# Altium project Guppy Buddy Rev A.PrjPCB (part 3 of 7)

## Sheet SOM Power.SchDoc: SOM Power
size Tabloid; ApprovedBy: NA; CompanyName: Cospan Design LLC; DrawnBy: David McCoy; Engineer: David McCoy; DocumentNumber: 3; Revision: A; SheetNumber: 3; SheetTotal: 18; Client: OSH; Project: Guppy Buddy; ProjectPrettyName: Guppy Buddy
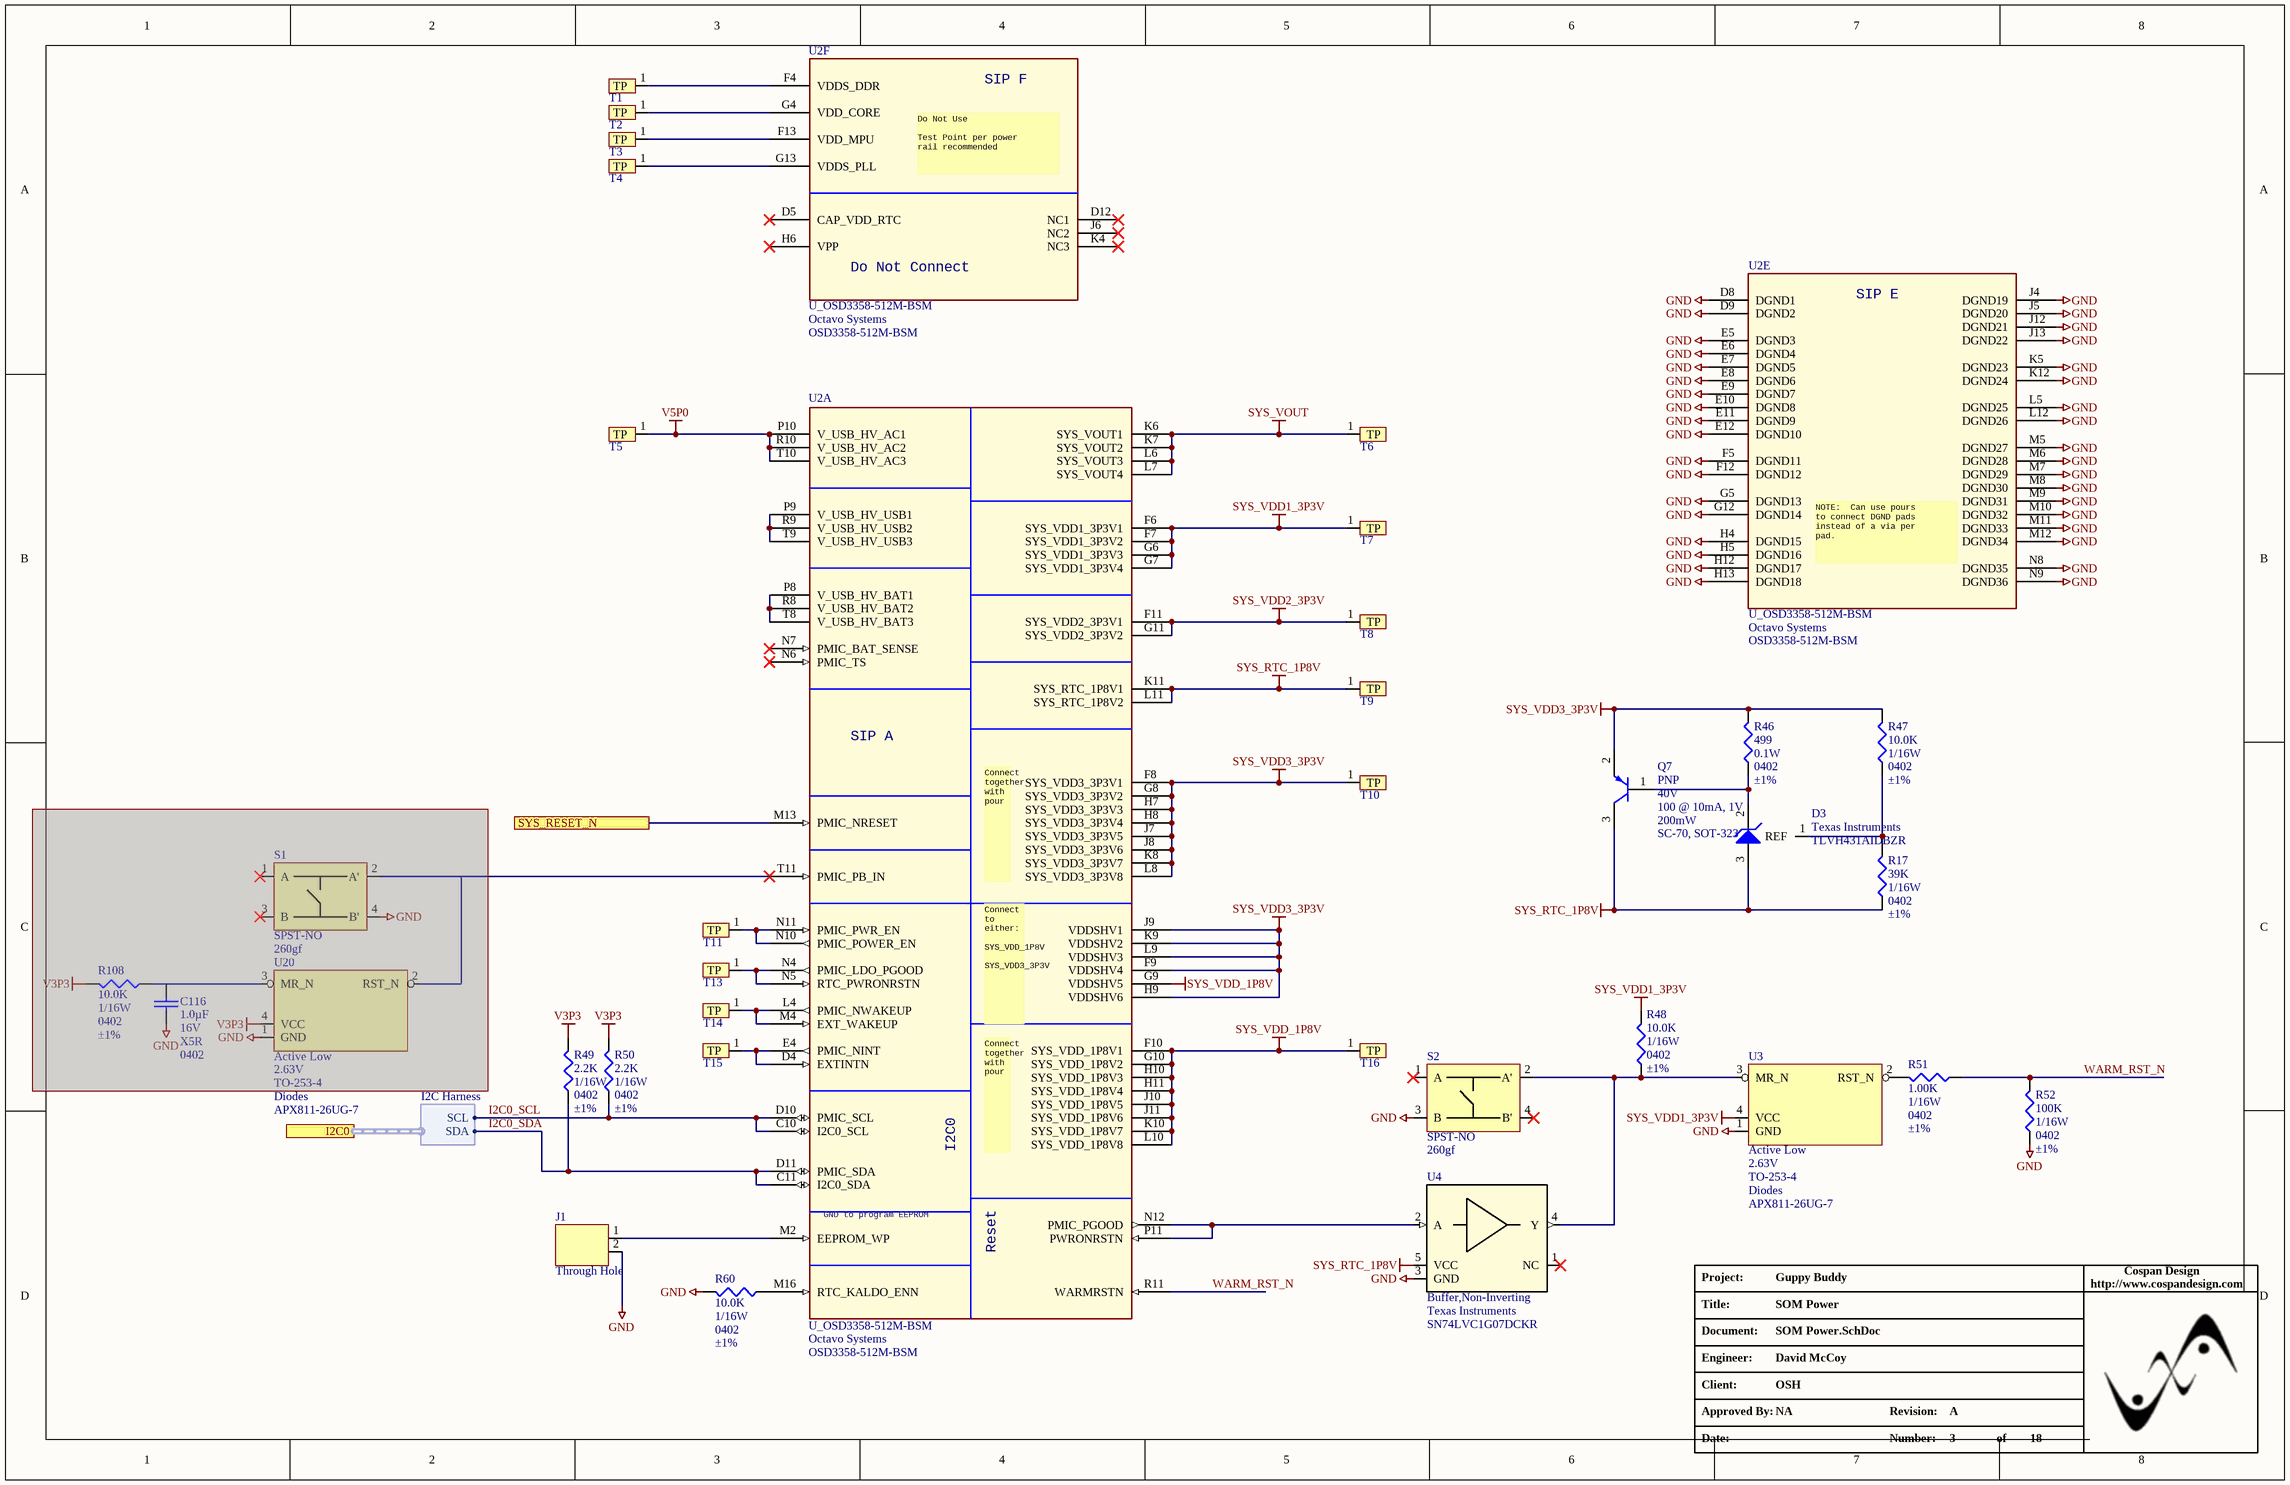
[diagram p3: SOM Power.SchDoc]

### Parts
(Parts that share a designator on the sheet are numbered #1, #2 ... from top to bottom, then left to right.)
C116  Capacitance: 1.0µF  Voltage - Rated: 16V  Temperature Coefficient: X5R  Package / Case: 0402  [C_0402]  (hidden comment: 1.0uF)  (masked out: inside a compile mask, not in the netlist)
D3  Manufacturer 1: Texas Instruments  Manufacturer Part Number 1: TLVH431AIDBZR  [SOT23]  (hidden comment: D_TLVH431AIDBZR)
J1  Mounting Type: Through Hole  [HDR_1X2]  (hidden comment: J_HDR1X2_JUMPER)
Q7  Voltage - Collector Emitter Breakdown (Max): 40V  DC Current Gain (hFE) (Min) @ Ic, Vce: 100 @ 10mA, 1V  Power - Max: 200mW  Package / Case: SC-70, SOT-323  [SOT-23A]  (hidden comment: PNP)
R17  Resistance In Ohms: 39K  Power (Watts): 1/16W  Case: 0402  Tolerance: ±1%  [R_0402]  (hidden comment: R_0402_39K)
R46  Resistance In Ohms: 499  Power (Watts): 0.1W  Case: 0402  Tolerance: ±1%  [R_0402]  (hidden comment: R_0402_499.0)
R47  Resistance In Ohms: 10.0K  Power (Watts): 1/16W  Case: 0402  Tolerance: ±1%  [R_0402]  (hidden comment: R_0402_10.0K)
R48  Resistance In Ohms: 10.0K  Power (Watts): 1/16W  Case: 0402  Tolerance: ±1%  [R_0402]  (hidden comment: R_0402_10.0K)
R49  Resistance In Ohms: 2.2K  Power (Watts): 1/16W  Case: 0402  Tolerance: ±1%  [R_0402]  (hidden comment: R_0402_2.2K)
R50  Resistance In Ohms: 2.2K  Power (Watts): 1/16W  Case: 0402  Tolerance: ±1%  [R_0402]  (hidden comment: R_0402_2.2K)
R51  Resistance In Ohms: 1.00K  Power (Watts): 1/16W  Case: 0402  Tolerance: ±1%  [R_0402]  (hidden comment: 1.0k Ohms)
R52  Resistance In Ohms: 100K  Power (Watts): 1/16W  Case: 0402  Tolerance: ±1%  [R_0402]  (hidden comment: R_0402_100K)
R60  Resistance In Ohms: 10.0K  Power (Watts): 1/16W  Case: 0402  Tolerance: ±1%  [R_0402]  (hidden comment: R_0402_10.0K)
R108#1  Resistance In Ohms: 10.0K  Power (Watts): 1/16W  Case: 0402  Tolerance: ±1%  [R_0402]  (hidden comment: R_0402_10.0K)  (masked out: inside a compile mask, not in the netlist)
S1#1  Circuit: SPST-NO  Operating Force: 260gf  [Tact Switch]  (hidden comment: S_TACTILE_BUTTON)  (masked out: inside a compile mask, not in the netlist)
S2  Circuit: SPST-NO  Operating Force: 260gf  [Tact Switch]  (hidden comment: S_TACTILE_BUTTON)
T1  TEST_POINT_SMALL  [TestPointSmall]  (value not drawn)  (no BOM)
T2  TEST_POINT_SMALL  [TestPointSmall]  (value not drawn)  (no BOM)
T3  TEST_POINT_SMALL  [TestPointSmall]  (value not drawn)  (no BOM)
T4  TEST_POINT_SMALL  [TestPointSmall]  (value not drawn)  (no BOM)
T5  TEST_POINT_SMALL  [TestPointSmall]  (value not drawn)  (no BOM)
T6  TEST_POINT_SMALL  [TestPointSmall]  (value not drawn)  (no BOM)
T7  TEST_POINT_SMALL  [TestPointSmall]  (value not drawn)  (no BOM)
T8  TEST_POINT_SMALL  [TestPointSmall]  (value not drawn)  (no BOM)
T9  TEST_POINT_SMALL  [TestPointSmall]  (value not drawn)  (no BOM)
T10  TEST_POINT_SMALL  [TestPointSmall]  (value not drawn)  (no BOM)
T11  TEST_POINT_SMALL  [TestPointSmall]  (value not drawn)  (no BOM)
T13  TEST_POINT_SMALL  [TestPointSmall]  (value not drawn)  (no BOM)
T14  TEST_POINT_SMALL  [TestPointSmall]  (value not drawn)  (no BOM)
T15  TEST_POINT_SMALL  [TestPointSmall]  (value not drawn)  (no BOM)
T16  TEST_POINT_SMALL  [TestPointSmall]  (value not drawn)  (no BOM)
U2  U_OSD3358-512M-BSM  Manufacturer 1: Octavo Systems  Manufacturer Part Number 1: OSD3358-512M-BSM  [OSD335X-BGA-256]  (parts A,E,F of 6)
U3  Reset: Active Low  Threshold Voltage: 2.63V  Case/Package: TO-253-4  Manufacturer 1: Diodes  Manufacturer Part Number 1: APX811-26UG-7  [SOT190P237X120-4N]  (hidden comment: U_APX811-26UG-7)
U4  Logic Function: Buffer,Non-Inverting  Manufacturer 1: Texas Instruments  Manufacturer Part Number 1: SN74LVC1G07DCKR  [DCK5]  (hidden comment: U_SN74LVC1G07DCKR)
U20  Reset: Active Low  Threshold Voltage: 2.63V  Case/Package: TO-253-4  Manufacturer 1: Diodes  Manufacturer Part Number 1: APX811-26UG-7  [SOT190P237X120-4N]  (hidden comment: U_APX811-26UG-7)  (masked out: inside a compile mask, not in the netlist)

### Ports
I2C0 (harness I2C Harness), SYS_RESET_N

### Harnesses
I2C Harness: SCL, SDA

### Nets
GND: J1.2 R52.2 R60.1 S2.3(B) U2.D8(DGND1) U2.D9(DGND2) U2.E5(DGND3) U2.E6(DGND4) U2.E7(DGND5) U2.E8(DGND6) U2.E9(DGND7) U2.E10(DGND8) U2.E11(DGND9) U2.E12(DGND10) U2.F5(DGND11) U2.F12(DGND12) U2.G5(DGND13) U2.G12(DGND14) U2.H4(DGND15) U2.H5(DGND16) U2.H12(DGND17) U2.H13(DGND18) U2.J4(DGND19) U2.J5(DGND20) U2.J12(DGND21) U2.J13(DGND22) U2.K5(DGND23) U2.K12(DGND24) U2.L5(DGND25) U2.L12(DGND26) U2.M5(DGND27) U2.M6(DGND28) U2.M7(DGND29) U2.M8(DGND30) U2.M9(DGND31) U2.M10(DGND32) U2.M11(DGND33) U2.M12(DGND34) U2.N8(DGND35) U2.N9(DGND36) U3.1(GND) U4.3(GND)
SYS_RTC_1P8V: D3.3(A) Q7.3(C) R17.1 T9.1(TP) U2.K11(SYS_RTC_1P8V1) U2.L11(SYS_RTC_1P8V2) U4.5(VCC)
SYS_VDD1_3P3V: R48.1 T7.1(TP) U2.F6(SYS_VDD1_3P3V1) U2.F7(SYS_VDD1_3P3V2) U2.G6(SYS_VDD1_3P3V3) U2.G7(SYS_VDD1_3P3V4) U3.4(VCC)
SYS_VDD2_3P3V: T8.1(TP) U2.F11(SYS_VDD2_3P3V1) U2.G11(SYS_VDD2_3P3V2)
SYS_VDD3_3P3V: Q7.2(E) R46.2 R47.2 T10.1(TP) U2.F8(SYS_VDD3_3P3V1) U2.F9(VDDSHV4) U2.G8(SYS_VDD3_3P3V2) U2.H7(SYS_VDD3_3P3V3) U2.H8(SYS_VDD3_3P3V4) U2.H9(VDDSHV6) U2.J7(SYS_VDD3_3P3V5) U2.J8(SYS_VDD3_3P3V6) U2.J9(VDDSHV1) U2.K8(SYS_VDD3_3P3V7) U2.K9(VDDSHV2) U2.L8(SYS_VDD3_3P3V8) U2.L9(VDDSHV3)
SYS_VDD_1P8V: T16.1(TP) U2.F10(SYS_VDD_1P8V1) U2.G9(VDDSHV5) U2.G10(SYS_VDD_1P8V2) U2.H10(SYS_VDD_1P8V3) U2.H11(SYS_VDD_1P8V4) U2.J10(SYS_VDD_1P8V5) U2.J11(SYS_VDD_1P8V6) U2.K10(SYS_VDD_1P8V7) U2.L10(SYS_VDD_1P8V8)
SYS_VOUT: T6.1(TP) U2.K6(SYS_VOUT1) U2.K7(SYS_VOUT2) U2.L6(SYS_VOUT3) U2.L7(SYS_VOUT4)
V3P3: R49.1 R50.1
V5P0: T5.1(TP) U2.P10(V_USB_HV_AC1) U2.R10(V_USB_HV_AC2) U2.T10(V_USB_HV_AC3)
I2C0_SCL: R50.2 U2.C10(I2C0_SCL) U2.D10(PMIC_SCL) ; port I2C0.SCL
I2C0_SDA: R49.2 U2.C11(I2C0_SDA) U2.D11(PMIC_SDA) ; port I2C0.SDA
WARM_RST_N: R51.2 R52.1 U2.R11(WARMRSTN)
NetD3_1: D3.1(REF) R17.2 R47.1
NetD3_2: D3.2(K) Q7.1(B) R46.1
NetJ1_1: J1.1 U2.M2(EEPROM_WP)
NetR48_2: R48.2 S2.2(A') U3.3(MR_N) U4.4(Y)
NetR51_1: R51.1 U3.2(RST_N)
NetR60_2: R60.2 U2.M16(RTC_KALDO_ENN)
NetT1_1: T1.1(TP) U2.F4(VDDS_DDR)
NetT2_1: T2.1(TP) U2.G4(VDD_CORE)
NetT3_1: T3.1(TP) U2.F13(VDD_MPU)
NetT4_1: T4.1(TP) U2.G13(VDDS_PLL)
NetT11_1: T11.1(TP) U2.N10(PMIC_POWER_EN) U2.N11(PMIC_PWR_EN)
NetT13_1: T13.1(TP) U2.N4(PMIC_LDO_PGOOD) U2.N5(RTC_PWRONRSTN)
NetT14_1: T14.1(TP) U2.L4(PMIC_NWAKEUP) U2.M4(EXT_WAKEUP)
NetT15_1: T15.1(TP) U2.D4(EXTINTN) U2.E4(PMIC_NINT)
NetU2_M13: U2.M13(PMIC_NRESET) ; port SYS_RESET_N
NetU2_N12: U2.N12(PMIC_PGOOD) U2.P11(PWRONRSTN) U4.2(A)
NetU2_P8: U2.P8(V_USB_HV_BAT1) U2.R8(V_USB_HV_BAT2) U2.T8(V_USB_HV_BAT3)
NetU2_P9: U2.P9(V_USB_HV_USB1) U2.R9(V_USB_HV_USB2) U2.T9(V_USB_HV_USB3)

Not connected (* = marked no-connect by the designer): S2 1(A)* 4(B')*; U2 D5(CAP_VDD_RTC)* D12(NC1)* H6(VPP)* J6(NC2)* K4(NC3)* N6(PMIC_TS)* N7(PMIC_BAT_SENSE)* T11(PMIC_PB_IN)*; U4 1(NC)*

### Notes on the sheet
- Project:
- http://www.cospandesign.com
- Cospan Design
- Document:
- Engineer:
- Title:
- Client:
- Approved By:
- Revision:
- Date:
- Number:
- of
- (in symbol U_OSD3358-512M-BSM, part A) SIP A; Connect together / with pour; Connect to either: / SYS_VDD_1P8V / SYS_VDD3_3P3V; I2C0; GND to program EEPROM; Reset
- (in symbol U_OSD3358-512M-BSM, part E) SIP E; NOTE:  Can use pours / to connect DGND pads / instead of a via per / pad.
- (in symbol U_OSD3358-512M-BSM, part F) SIP F; Do Not Use / Test Point per power / rail recommended; Do Not Connect

### Library data of the parts
C116 = C_0402_1.0UF_16V: CAP CER 1.0UF 16V X5R 0402; Manufacturer 1: Samsung; Manufacturer Part Number 1: CL05A105KO5NNNC; Tolerance: 10%; Description 1: Cap Ceramic 1uF 16V X5R 10% SMD 0402 85C Paper T/R; Supplier 1: Digi-Key; Stock 1: 26908; Pricing 1: 1=0.1, 10=0.062, 100=0.0276, 500=0.01968, 1000=0.01547, 2500=0.01406, 5000=0.01294 (USD); Packaging: Tape and Reel; ComponentLink1URL: http://ds.yuden.co.jp/TYCOMPAS/ut/detail.do?productNo=EMK105BJ105KV-F&fileName=EMK105BJ105KV-F_SS&mode=specSheetDownload; ComponentLink1Description: http://ds.yuden.co.jp/TYCOMPAS/ut/detail.do?productNo=EMK105BJ105KV-F&fileName=EMK105BJ105KV-F_SS&mode=specSheetDownload; Supplier Part Number 1: 1276-1067-6-ND; ComponentLink2URL: https://datasheet.ciiva.com/16207/cl05a105ko5nnnc-16207571.pdf; ComponentLink2Description: https://datasheet.ciiva.com/16207/cl05a105ko5nnnc-16207571.pdf; ComponentLink3URL: https://datasheet.ciiva.com/15195/getdatasheetpartid-355272-15195629.pdf; ComponentLink3Description: https://datasheet.ciiva.com/15195/getdatasheetpartid-355272-15195629.pdf; Mount: Surface Mount; Case/Package: 0402; Case Code (Metric): 1005; Case Code (Imperial): 0402; Contact Plating: Tin; Min Operating Temperature: -55°C; Max Operating Temperature: 85°C; Dielectric: X5R; Package Quantity: 1; Voltage Rating: 16V; Voltage: 16V; Length: 1mm; Height: 0.5mm; Width: 0.02inch; Thickness: 0.022inch; Depth: 0.5mm; Radiation Hardening: No
D3 = D_TLVH431AIDBZR: IC VREF SHUNT ADJ SOT23-3; Built_By: EMA_UL_Team; Type: DEV; C: Copyright (C) 2015 Accelerated Designs. All rights reserved; Output Voltage: 18V; Output Current: 70mA; Max Input Voltage: 20V; Number of Channels: 1; Tolerance: 1%; Max Output Current: 80mA; Temperature Coefficient: 129ppm/°C; Cathode Current: 100uA; Reference Type: Shunt,Adjustable; Vendor: Texas Instruments; Manufacturer_Part_Number: TLVH431AIDBZR; Manufacturer: Texas Instruments; RefDes: RefDes; Value: Value; Supplier 1: Digi-Key; Supplier Part Number 1: 296-17970-6-ND; Description 1: IC VREF SHUNT ADJ SOT23-3; Stock 1: 8302; Pricing 1: 1=0.75, 10=0.659, 100=0.5055, 500=0.39964, 1000=0.31971 (USD); Case/Package: SOT-23; Number of Pins: 3; Min Operating Temperature: -40°C; Max Operating Temperature: 125°C; Packaging: Tape and Reel; Package Quantity: 1; Max Output Voltage: 18V; Reference Voltage: 18V; Radiation Hardening: No; Lead Free: Lead Free; REACH SVHC: No SVHC; ComponentLink1URL: https://datasheet.ciiva.com/8055/1772203-8055424.pdf; ComponentLink1Description: https://datasheet.ciiva.com/8055/1772203-8055424.pdf; ComponentLink2URL: https://datasheet.ciiva.com/3236/tlvh432b-3236469.pdf; ComponentLink2Description: https://datasheet.ciiva.com/3236/tlvh432b-3236469.pdf; ComponentLink3URL: https://datasheet.ciiva.com/2006/tlvh431a-2006475.pdf; ComponentLink3Description: https://datasheet.ciiva.com/2006/tlvh431a-2006475.pdf; ComponentLink4URL: https://datasheet.ciiva.com/2006/tlvh431a-2006476.pdf; ComponentLink4Description: https://datasheet.ciiva.com/2006/tlvh431a-2006476.pdf; ComponentLink5URL: https://datasheet.ciiva.com/2006/tlvh431a-2006477.pdf; ComponentLink5Description: https://datasheet.ciiva.com/2006/tlvh431a-2006477.pdf; ComponentLink6URL: https://datasheet.ciiva.com/3235/tlvh432b-3235662.pdf; ComponentLink6Description: https://datasheet.ciiva.com/3235/tlvh432b-3235662.pdf
J1 = J_HDR1X2_JUMPER: CONN HEADER .100" 2POS TIN PCB; Manufacturer: Samtec; Manufacturer Part Number: TSW-102-07-T-S; Number of Positions: 2; Connector Type: Unshrouded; Number of Positions Loaded: All; Pitch: 0.100" (2.54mm); NOTE: This is a 1X12 header; Category: Connectors, Interconnects; Number of Rows: 1; Supplier 1: Samtec; Supplier Part Number 1: TSW-102-07-T-S; RoHS: RoHS Compliant; Row Spacing: -; Height Stacking (Mating): -; Molding Height Above Board: 0.100" (2.54mm); Contact Mating Length: 0.166" (4.22mm); Termination: Solder; Contact Finish: Tin; Contact Finish Thickness: 200µin (5.08µm); Features: -; Color: Black; ComponentLink1URL: http://www.samtec.com/ftppub/pdf/TD.PDF; ComponentLink1Description: http://www.samtec.com/ftppub/pdf/TD.PDF
Q7 = Q_PNP_200MA: TRANS PNP MED PWR 400V SOT23-3; Manufacturer: Diodes Inc; Manufacturer Part Number: MMST3906-7-F; Current - Collector (Ic) (Max): 200mA; Vce Saturation (Max) @ Ib, Ic: 300mV @ 5mA, 50mA; Frequency - Transition: 300MHz; Supplier 1: Digi-Key; Supplier Part Number 1: MMST3906-FDICT-ND; RoHS: RoHS Compliant; Category: Discrete Semiconductor Products; Stock 1: 21496; Pricing: 1=0.5, 10=0.34, 100=0.16, 250=0.114, 500=0.087, 1000=0.06 (USD); Current - Collector Cutoff (Max): -; Mounting Type: Surface Mount; Packaging: Cut Tape (CT); Supplier Device Package: SOT-323; ComponentLink1URL: http://www.diodes.com/datasheets/ds30079.pdf; ComponentLink1Description: http://www.diodes.com/datasheets/ds30079.pdf; Transistor Type: PNP
R17 = R_0402_39K: RES SMD 39K OHM 1% 1/10W 0402; Manufacturer: Panasonic Electronic Components; Manufacturer Part Number: ERJ-2RKF3902X; Temperature Coefficient: ±100ppm/°C; Supplier 1: Digi-Key; RoHS: RoHS Compliant; Category: Resistors; Stock 1: 304822; Pricing 1: 1=0.1, 50=0.0196, 100=0.0149, 250=0.01104, 500=0.00816, 1000=0.00544, 5000=0.00383 (USD); Packaging: Cut Tape (CT); Resistance (Ohms): 39k; Composition: Thick Film; Features: Automotive AEC-Q200; Operating Temperature: -55°C ~ 155°C; Package / Case: 0402 (1005 Metric); Supplier Device Package: 0402; Size / Dimension: 0.039" L x 0.020" W (1.00mm x 0.50mm); Height: 0.016" (0.40mm); Number of Terminations: 2; ComponentLink1URL: http://industrial.panasonic.com/www-cgi/jvcr13pz.cgi?E+PZ+3+AOA0002+ERJ2RKF3902X+7+WW; ComponentLink1Description: http://industrial.panasonic.com/www-cgi/jvcr13pz.cgi?E+PZ+3+AOA0002+ERJ2RKF3902X+7+WW; Supplier Part Number 1: P39.0KLCT-ND
R46 = R_0402_499.0: RES 499 OHM 1/10W 1% 0402 SMD; Manufacturer: Panasonic - ECG; Manufacturer Part Number: ERJ-2RKF4990X; Temperature Coefficient: ±100ppm/°C; Supplier 1: Digi-Key; Supplier Part Number 1: P499LCT-ND; RoHS: RoHS Compliant; Category: Resistors; Stock 1: 1490570; Pricing: 1=0.06, 50=0.0242, 100=0.0184, 250=0.01364, 500=0.01008, 1000=0.00672, 5000=0.00473 (USD); Composition: Thick Film; Features: -; Size / Dimension: 0.039" L x 0.020" W (1.00mm x 0.50mm); Height: 0.014" (0.35mm); Number of Terminations: 2; Packaging: Cut Tape (CT); Package / Case: 0402 (1005 Metric); ComponentLink1URL: http://industrial.panasonic.com/www-cgi/jvcr13pz.cgi?E+PZ+3+AOA0002+ERJ2RKF4990X+7+WW; ComponentLink1Description: http://industrial.panasonic.com/www-cgi/jvcr13pz.cgi?E+PZ+3+AOA0002+ERJ2RKF4990X+7+WW
R47 R48 R60 R108#1 = R_0402_10.0K: RES 10.0K OHM 1/16W 1% 0402 SMD; Manufacturer: Stackpole Electronics Inc; Manufacturer Part Number: RMCF0402FT10K0; Resistance (Ohms): 10k; Temperature Coefficient: ±100ppm/°C; Supplier 1: Digi-Key; Supplier Part Number 1: RMCF0402FT10K0CT-ND; RoHS: RoHS Compliant; Category: Resistors; Stock 1: 234525; Pricing: 1=0.04, 10=0.025, 50=0.0138, 100=0.0105, 250=0.0078, 500=0.00576, 1000=0.00384, 2500=0.00324, 5000=0.0027 (USD); Composition: Thick Film; Features: -; Package / Case: 0402 (1005 Metric); Size / Dimension: 0.039" L x 0.020" W (1.00mm x 0.50mm); Height: 0.016" (0.40mm); Number of Terminations: 2; Packaging: Cut Tape (CT); ComponentLink1URL: http://www.seielect.com/Catalog/SEI-RMCF_RMCP.pdf; ComponentLink1Description: http://www.seielect.com/Catalog/SEI-RMCF_RMCP.pdf
R49 R50 = R_0402_2.2K: RES SMD 2.2K OHM 1% 1/10W 0402; Manufacturer: Panasonic Electronic Components; Manufacturer Part Number: ERJ-2RKF2201X; Temperature Coefficient: ±100ppm/°C; Supplier 1: Digi-Key; RoHS: RoHS Compliant; Category: Resistors; Stock 1: 1256647; Pricing 1: 1=0.1, 50=0.015, 100=0.011, 250=0.0084, 500=0.00674, 1000=0.00496, 5000=0.00355 (USD); Packaging: Cut Tape (CT); Resistance (Ohms): 2.2k; Composition: Thick Film; Features: Automotive AEC-Q200; Operating Temperature: -55°C ~ 155°C; Package / Case: 0402 (1005 Metric); Supplier Device Package: 0402; Size / Dimension: 0.039" L x 0.020" W (1.00mm x 0.50mm); Height: 0.016" (0.40mm); Number of Terminations: 2; ComponentLink1URL: http://industrial.panasonic.com/www-cgi/jvcr13pz.cgi?E+PZ+3+AOA0002+ERJ2RKF2201X+7+WW; ComponentLink1Description: http://industrial.panasonic.com/www-cgi/jvcr13pz.cgi?E+PZ+3+AOA0002+ERJ2RKF2201X+7+WW; Supplier Part Number 1: P2.20KLCT-ND
R51 = R_0402_1.0K: RES 1.00K OHM 1/16W 1% 0402 SMD; Manufacturer: Yageo; Manufacturer Part Number: RC0402FR-071KL; Resistance (Ohms): 1K; Temperature Coefficient: ±100ppm/°C; Supplier 1: Digi-Key; Supplier Part Number 1: 311-1.00KLRCT-ND; RoHS: RoHS Compliant; Category: Resistors; Stock 1: 2103351; Pricing: 10=0.014, 100=0.0063, 500=0.00382, 1000=0.0027, 5000=0.00203 (USD); Composition: Thick Film; Features: -; Package / Case: 0402 (1005 Metric); Size / Dimension: 0.039" L x 0.020" W (1.00mm x 0.50mm); Height: 0.016" (0.40mm); Number of Terminations: 2; Packaging: Cut Tape (CT); ComponentLink1URL: http://www.yageo.com/documents/recent/PYu-RC0402_51_RoHS_L_6.pdf; ComponentLink1Description: http://www.yageo.com/documents/recent/PYu-RC0402_51_RoHS_L_6.pdf
R52 = R_0402_100K: RES SMD 100K OHM 1% 1/16W 0402; Manufacturer: Yageo; Manufacturer Part Number: RC0402FR-07100KL; Temperature Coefficient: ±100ppm/°C; Supplier 1: Digi-Key; RoHS: RoHS Compliant; Category: Resistors; Stock 1: 4989982; Pricing 1: 1=0.1, 10=0.013, 25=0.0096, 100=0.0054, 250=0.00412, 500=0.00328, 1000=0.00242, 2500=0.0021, 5000=0.00173 (USD); Packaging: Cut Tape (CT); Resistance (Ohms): 100k; Composition: Thick Film; Features: Moisture Resistant; Operating Temperature: -55°C ~ 155°C; Package / Case: 0402 (1005 Metric); Supplier Device Package: 0402; Size / Dimension: 0.039" L x 0.020" W (1.00mm x 0.50mm); Height: 0.016" (0.40mm); Number of Terminations: 2; ComponentLink1URL: http://www.yageo.com/NewPortal/yageodocoutput?fileName=/pdf/R-Chip/PYu-RC_Group_51_RoHS_L_3.pdf; ComponentLink1Description: http://www.yageo.com/NewPortal/yageodocoutput?fileName=/pdf/R-Chip/PYu-RC_Group_51_RoHS_L_3.pdf; Supplier Part Number 1: 311-100KLRCT-ND
S1#1 S2 = S_TACTILE_BUTTON: SWITCH TACTILE SPST-NO 0.02A 15V; Manufacturer: Panasonic - ECG; Manufacturer Part Number: EVQ-Q2U02W; Switch Function: Off-Mom; Contact Rating @ Voltage: 0.02A @ 15VDC; Actuator Type: Standard; Actuator Orientation: Top Actuated; Outline: 6.60mm x 6.00mm; Illumination: Non-Illuminated; Supplier 1: Digi-Key; Supplier Part Number 1: P12954SCT-ND; RoHS: RoHS Compliant; Category: Switches; Stock 1: 21488; Pricing: 1=0.4, 10=0.374, 25=0.3208, 50=0.2726, 100=0.262, 250=0.23524, 500=0.22454, 1000=0.18711 (USD); Mounting Type: Surface Mount; Termination Style: SMD (SMT) Tab; Packaging: Cut Tape (CT); ComponentLink1URL: http://industrial.panasonic.com/www-data/pdf/ATK0000/ATK0000CE28.pdf; ComponentLink1Description: http://industrial.panasonic.com/www-data/pdf/ATK0000/ATK0000CE28.pdf
T1-T11 T13-T16 = TEST_POINT_SMALL: OSCILLOSCOPE TEST POINT
U3 U20 = U_APX811-26UG-7: Processor Supervisor 2.63V 2.5V/3V/3.3V/5V 4-Pin(3+Tab) SOT-143 T/R; Min Supply Voltage: 1.1V; Max Supply Voltage: 5.5V; Max Power Dissipation: 320mW; Number of Voltages Monitored: 1; Reset Timeout: 140ms; Watchdog Timer: No; Max Reset Threshold Voltage: 2.67V; Min Reset Threshold Voltage: 2.59V; Supplier 1: Digi-Key; Supplier Part Number 1: APX811-26UG-7DKR-ND; Description 1: Processor Supervisor 2.63V 2.5V/3V/3.3V/5V 4-Pin(3+Tab) SOT-143 T/R; Stock 1: 3187; Pricing 1: 1=0.41, 10=0.348, 100=0.2596, 500=0.20394, 1000=0.15759 (USD); Mount: Surface Mount; Number of Pins: 4; Min Operating Temperature: -40°C; Max Operating Temperature: 85°C; Packaging: Tape and Reel; Package Quantity: 1; Number of Elements: 1; Power Dissipation: 320mW; Type: Simple Reset/Power-On Reset; Radiation Hardening: No; REACH SVHC: No SVHC; ComponentLink1URL: https://datasheet.ciiva.com/17224/apx811-812-17224730.pdf; ComponentLink1Description: https://datasheet.ciiva.com/17224/apx811-812-17224730.pdf; ComponentLink2URL: https://datasheet.ciiva.com/26949/getdatasheetpartid-661887-26949338.pdf; ComponentLink2Description: https://datasheet.ciiva.com/26949/getdatasheetpartid-661887-26949338.pdf
U4 = U_SN74LVC1G07DCKR: IC BUFF/DVR NON-INVERT SC705; Number of Channels: 1; Max Supply Voltage: 5.5V; Min Supply Voltage: 1.65V; Propagation Delay: 8.3ns; Low Level Output Current: 32mA; Polarity: Non-Inverting; Quiescent Current: 10uA; Nominal Supply Current: 40mA; ComponentLink1URL: https://datasheet.ciiva.com/4788/sn74lvc1g07-224894-4788496.pdf; ComponentLink1Description: https://datasheet.ciiva.com/4788/sn74lvc1g07-224894-4788496.pdf; ComponentLink2URL: https://datasheet.ciiva.com/1833/sn74lvc1g07-1833618.pdf; ComponentLink2Description: https://datasheet.ciiva.com/1833/sn74lvc1g07-1833618.pdf; ComponentLink3URL: https://datasheet.ciiva.com/1833/sn74lvc1g07-1833619.pdf; ComponentLink3Description: https://datasheet.ciiva.com/1833/sn74lvc1g07-1833619.pdf; ComponentLink4URL: https://datasheet.ciiva.com/1833/sn74lvc1g07-1833620.pdf; ComponentLink4Description: https://datasheet.ciiva.com/1833/sn74lvc1g07-1833620.pdf; ComponentLink5URL: https://datasheet.ciiva.com/14300/sn74lvc1g07-14300981.pdf; ComponentLink5Description: https://datasheet.ciiva.com/14300/sn74lvc1g07-14300981.pdf; ComponentLink6URL: https://datasheet.ciiva.com/15094/getdatasheetpartid-189690-15094949.pdf; ComponentLink6Description: https://datasheet.ciiva.com/15094/getdatasheetpartid-189690-15094949.pdf; ComponentLink7URL: https://datasheet.ciiva.com/14300/sn74lvc1g07-14300984.pdf; ComponentLink7Description: https://datasheet.ciiva.com/14300/sn74lvc1g07-14300984.pdf; ComponentLink8URL: https://datasheet.ciiva.com/46442/1856316-46442060.pdf; ComponentLink8Description: https://datasheet.ciiva.com/46442/1856316-46442060.pdf; ComponentLink9URL: https://datasheet.ciiva.com/28662/1887570-28662702.pdf; ComponentLink9Description: https://datasheet.ciiva.com/28662/1887570-28662702.pdf; ComponentLink10URL: https://datasheet.ciiva.com/46384/1887570-46384078.pdf; ComponentLink10Description: https://datasheet.ciiva.com/46384/1887570-46384078.pdf; ComponentLink11URL: https://datasheet.ciiva.com/48704/001075278-da-01-en-ic-buff-dvr-sn74lvc1g07dckr-sc-70-5-tid-48704263.pdf; ComponentLink11Description: https://datasheet.ciiva.com/48704/001075278-da-01-en-ic-buff-dvr-sn74lvc1g07dckr-sc-70-5-tid-48704263.pdf; Supplier 1: Digi-Key; Supplier Part Number 1: 296-8486-1-ND; Description 1: IC BUFF/DVR NON-INVERT SC705; Stock 1: 157346; Pricing 1: 1=0.43, 10=0.32, 100=0.1996, 500=0.13658, 1000=0.10506 (USD); Mount: Surface Mount; Case/Package: SC; Number of Pins: 5; Contact Plating: Gold; Min Operating Temperature: -40°C; Max Operating Temperature: 125°C; Number of Inputs: 1; Number of Outputs: 1; Packaging: Tape and Reel; Package Quantity: 3000; Number of Elements: 1; Number of Input Lines: 1; Number of Output Lines: 1; Number of Bits per Element: 1; Turn-On Delay Time: 8.3ns; High Level Output Current: 32mA; Termination: SMD/SMT; Number of Circuits: 1; Number of Gates: 1; Number of Bits: 1; Radiation Hardening: No; REACH SVHC: No SVHC; Lead Free: Lead Free
U2 = U_OSD3358-512M-BSM: Supplier 1: Digi-Key; Supplier Part Number 1: 1676-1002-ND; Stock 1: 592; Pricing 1: 1=43.73, 10=41.08, 100=36.84 (USD)

## Sheet SOM Analog USB.SchDoc: SOM/Analog/USB
size Tabloid; ApprovedBy: NA; CompanyName: Cospan Design LLC; DrawnBy: David McCoy; Engineer: David McCoy; DocumentNumber: 4; Revision: A; SheetNumber: 4; SheetTotal: 18; Client: OSH; Project: Guppy Buddy; ProjectPrettyName: Guppy Buddy
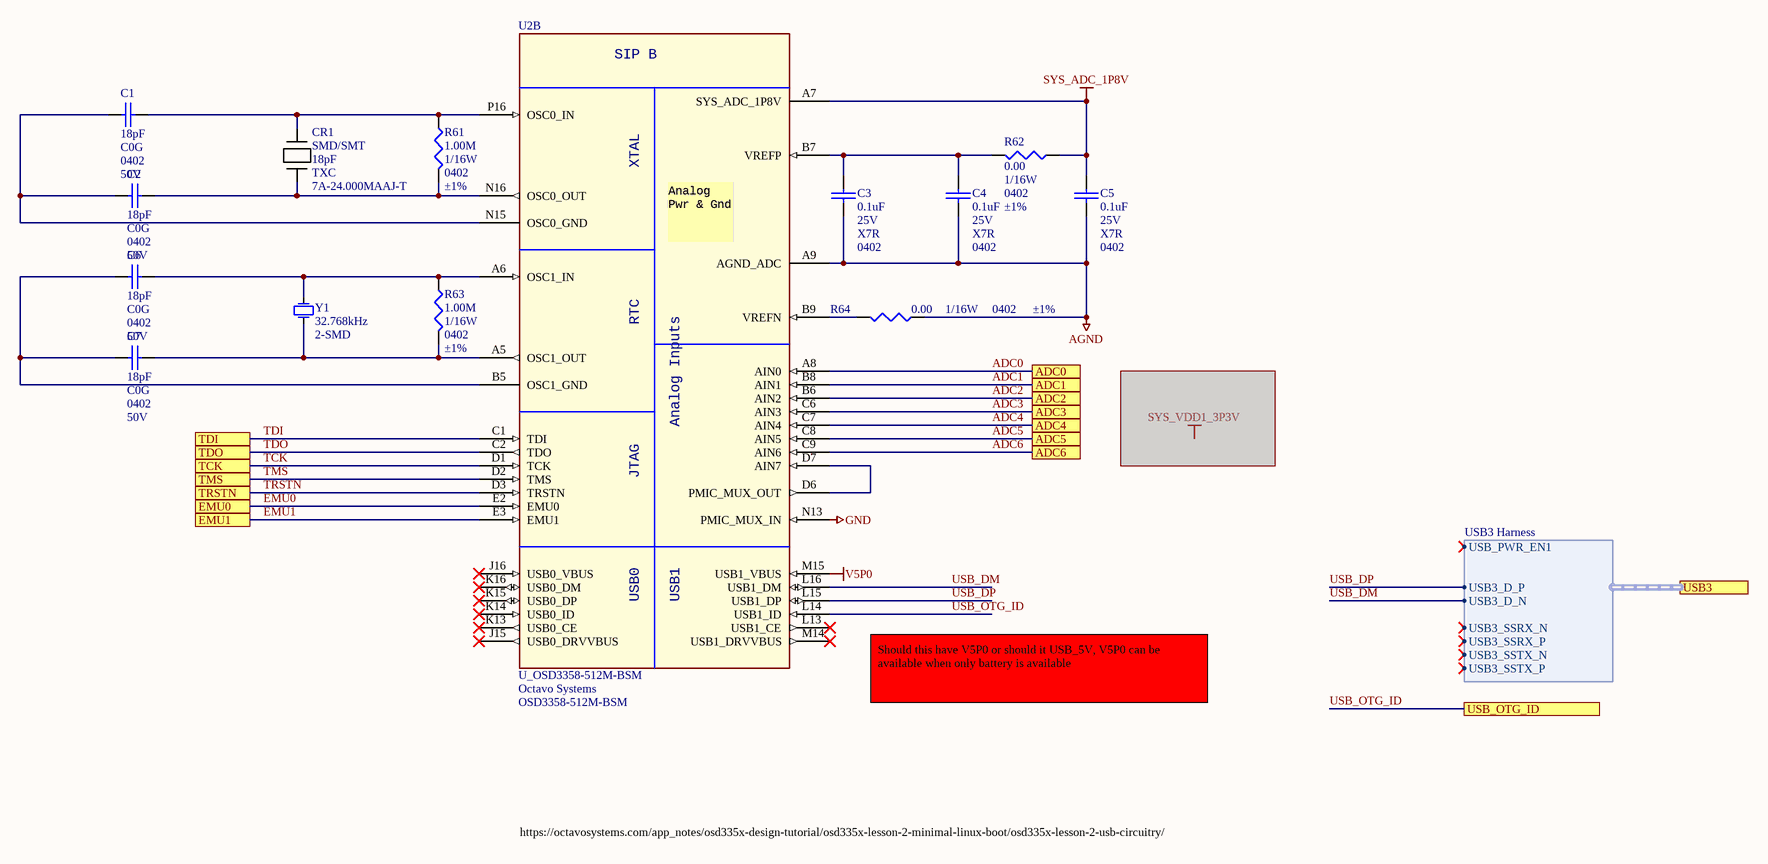
[diagram p4: SOM Analog USB.SchDoc]

### Parts
C1  Capacitance: 18pF  Dielectric: C0G  Case Code (Imperial): 0402  Voltage Rating: 50V  [C_0402]  (hidden comment: C_0402_18PF_50V)
C2  Capacitance: 18pF  Dielectric: C0G  Case Code (Imperial): 0402  Voltage Rating: 50V  [C_0402]  (hidden comment: C_0402_18PF_50V)
C3  Capacitance: 0.1uF  Voltage - Rated: 25V  Temperature Coefficient: X7R  Package / Case: 0402  [C_0402]  (hidden comment: C_0402_0.1UF_25V)
C4  Capacitance: 0.1uF  Voltage - Rated: 25V  Temperature Coefficient: X7R  Package / Case: 0402  [C_0402]  (hidden comment: C_0402_0.1UF_25V)
C5  Capacitance: 0.1uF  Voltage - Rated: 25V  Temperature Coefficient: X7R  Package / Case: 0402  [C_0402]  (hidden comment: C_0402_0.1UF_25V)
C6  Capacitance: 18pF  Dielectric: C0G  Case Code (Imperial): 0402  Voltage Rating: 50V  [C_0402]  (hidden comment: C_0402_18PF_50V)
C7  Capacitance: 18pF  Dielectric: C0G  Case Code (Imperial): 0402  Voltage Rating: 50V  [C_0402]  (hidden comment: C_0402_18PF_50V)
CR1  Case/Package: SMD/SMT  Load Capacitance: 18pF  Manufacturer 1: TXC  Manufacturer Part Number 1: 7A-24.000MAAJ-T  [CRYSTAL_TXC_7A]  (hidden comment: Y_7A-24.000MAAJ-T)
R61  Resistance In Ohms: 1.00M  Power (Watts): 1/16W  Case: 0402  Tolerance: ±1%  [R_0402]  (hidden comment: 1.0M Ohms)
R62  Resistance In Ohms: 0.00  Power (Watts): 1/16W  Case: 0402  Tolerance: ±1%  [R_0402]  (hidden comment: 0.0 Ohms)
R63  Resistance In Ohms: 1.00M  Power (Watts): 1/16W  Case: 0402  Tolerance: ±1%  [R_0402]  (hidden comment: 1.0M Ohms)
R64  Resistance In Ohms: 0.00  Power (Watts): 1/16W  Case: 0402  Tolerance: ±1%  [R_0402]  (hidden comment: 0.0 Ohms)
U2  U_OSD3358-512M-BSM  Manufacturer 1: Octavo Systems  Manufacturer Part Number 1: OSD3358-512M-BSM  [OSD335X-BGA-256]  (part B of 6)
Y1  Frequency: 32.768kHz  Package / Case: 2-SMD  [FC-135_CRYSTAL]  (hidden comment: 32.768kHz (Tuning Fork))

### Ports
ADC0, ADC1, ADC2, ADC3, ADC4, ADC5, ADC6, EMU0, EMU1, TCK, TDI, TDO, TMS, TRSTN, USB3 (harness USB3 Harness), USB_OTG_ID

### Harnesses
USB3 Harness: USB_PWR_EN1, USB3_D_N, USB3_D_P, USB3_SSRX_N, USB3_SSRX_P, USB3_SSTX_N, USB3_SSTX_P

### Nets
AGND: C3.1 C4.1 C5.1 R64.2 U2.A9(AGND_ADC)
GND: U2.N13(PMIC_MUX_IN)
SYS_ADC_1P8V: C5.2 R62.2 U2.A7(SYS_ADC_1P8V)
V5P0: U2.M15(USB1_VBUS)
ADC0: U2.A8(AIN0) ; port ADC0
ADC1: U2.B8(AIN1) ; port ADC1
ADC2: U2.B6(AIN2) ; port ADC2
ADC3: U2.C6(AIN3) ; port ADC3
ADC4: U2.C7(AIN4) ; port ADC4
ADC5: U2.C8(AIN5) ; port ADC5
ADC6: U2.C9(AIN6) ; port ADC6
EMU0: U2.E2(EMU0) ; port EMU0
EMU1: U2.E3(EMU1) ; port EMU1
TCK: U2.D1(TCK) ; port TCK
TDI: U2.C1(TDI) ; port TDI
TDO: U2.C2(TDO) ; port TDO
TMS: U2.D2(TMS) ; port TMS
TRSTN: U2.D3(TRSTN) ; port TRSTN
USB_DM: U2.L16(USB1_DM) ; port USB3.USB3_D_N
USB_DP: U2.L15(USB1_DP) ; port USB3.USB3_D_P
USB_OTG_ID: U2.L14(USB1_ID) ; port USB_OTG_ID
NetC1_1: C1.1 C2.1 U2.N15(OSC0_GND)
NetC1_2: C1.2 CR1.2 R61.2 U2.P16(OSC0_IN)
NetC2_2: C2.2 CR1.1 R61.1 U2.N16(OSC0_OUT)
NetC3_2: C3.2 C4.2 R62.1 U2.B7(VREFP)
NetC6_1: C6.1 C7.1 U2.B5(OSC1_GND)
NetC6_2: C6.2 R63.2 U2.A6(OSC1_IN) Y1.1
NetC7_2: C7.2 R63.1 U2.A5(OSC1_OUT) Y1.2
NetR64_1: R64.1 U2.B9(VREFN)
NetU2_D6: U2.D6(PMIC_MUX_OUT) U2.D7(AIN7)

Not connected (* = marked no-connect by the designer): U2 J15(USB0_DRVVBUS)* J16(USB0_VBUS)* K13(USB0_CE)* K14(USB0_ID)* K15(USB0_DP)* K16(USB0_DM)* L13(USB1_CE)* M14(USB1_DRVVBUS)*

### Notes on the sheet
- Should this have V5P0 or should it USB_5V, V5P0 can be available when only battery is available
- https://octavosystems.com/app_notes/osd335x-design-tutorial/osd335x-lesson-2-minimal-linux-boot/osd335x-lesson-2-usb-circuitry/
- Project:
- http://www.cospandesign.com
- Cospan Design
- Document:
- Engineer:
- Title:
- Client:
- Approved By:
- Revision:
- Date:
- Number:
- of
- (in symbol U_OSD3358-512M-BSM, part B) SIP B; XTAL; Analog / Pwr & Gnd; RTC; Analog Inputs; JTAG; USB0; USB1

### Library data of the parts
C1 C2 C6 C7 = C_0402_18PF_50V: Manufacturer Part Number 1: UMK105CG180JV-F; Manufacturer 1: Taiyo Yuden; Tolerance: 5%; Description 1: CAP CER 18PF 50V NP0 0402; Supplier 1: Digi-Key; Supplier Part Number 1: 587-1950-6-ND; Stock 1: 0; Thickness: 0.022inch; Packaging: Tape and Reel; ComponentLink1URL: http://search.murata.co.jp/Ceramy/image/img/A01X/G101/ENG/GRM1555C1H180FA01-01.pdf; ComponentLink1Description: http://search.murata.co.jp/Ceramy/image/img/A01X/G101/ENG/GRM1555C1H180FA01-01.pdf; Pricing 1: 1=0.1, 10=0.032, 100=0.0141, 500=0.01006, 1000=0.00791, 2500=0.00719, 5000=0.00661 (USD); Mount: Surface Mount; Case/Package: 0402; Case Code (Metric): 1005; Min Operating Temperature: -55°C; Max Operating Temperature: 125°C; Package Quantity: 1; Voltage Rating (DC): 50V; Termination: SMD/SMT; Length: 1mm; Height: 0.5mm; Width: 0.02inch; Depth: 0.5mm; Radiation Hardening: No; REACH SVHC: Unknown; Lead Free: Lead Free; Halogen Free: Halogen Free; ComponentLink2URL: https://datasheet.ciiva.com/129/standardmultilayerceramiccaps-129795.pdf; ComponentLink2Description: https://datasheet.ciiva.com/129/standardmultilayerceramiccaps-129795.pdf; ComponentLink3URL: https://datasheet.ciiva.com/129/standardmultilayerceramiccaps-129796.pdf; ComponentLink3Description: https://datasheet.ciiva.com/129/standardmultilayerceramiccaps-129796.pdf; ComponentLink4URL: https://datasheet.ciiva.com/129/standardmultilayerceramiccaps-129797.pdf; ComponentLink4Description: https://datasheet.ciiva.com/129/standardmultilayerceramiccaps-129797.pdf; ComponentLink5URL: https://datasheet.ciiva.com/28645/1481447-28645301.pdf; ComponentLink5Description: https://datasheet.ciiva.com/28645/1481447-28645301.pdf; ComponentLink6URL: https://datasheet.ciiva.com/7975/1500421-7975897.pdf; ComponentLink6Description: https://datasheet.ciiva.com/7975/1500421-7975897.pdf; ComponentLink7URL: https://datasheet.ciiva.com/30064/dumk-e-30064475.pdf; ComponentLink7Description: https://datasheet.ciiva.com/30064/dumk-e-30064475.pdf; ComponentLink8URL: https://datasheet.ciiva.com/5418/mlcc-all-e-541559-5418829.pdf; ComponentLink8Description: https://datasheet.ciiva.com/5418/mlcc-all-e-541559-5418829.pdf
C3-C5 = C_0402_0.1UF_25V: CAP CER 0.1UF 25V X6S 0402; Manufacturer 1: Yageo; Manufacturer Part Number 1: CC0402KRX7R8BB104; Description 1: Cap Ceramic 0.1uF 25V X7R 10% SMD 0402 125C Paper T/R; Tolerance: 10%; Dissipation Factor: 3.5%; ComponentLink1URL: https://product.tdk.com/info/en/catalog/datasheets/mlcc_commercial_general_en.pdf; ComponentLink1Description: https://product.tdk.com/info/en/catalog/datasheets/mlcc_commercial_general_en.pdf; Supplier 1: Digi-Key; Supplier Part Number 1: 311-2077-1-ND; Stock 1: 0; Pricing 1: 1=0.1, 10=0.048, 100=0.0215, 500=0.01534, 1000=0.01205, 2500=0.01095, 5000=0.01007 (USD); Mount: Surface Mount; Case/Package: 0402; Case Code (Imperial): 0402; Case Code (Metric): 1005; Min Operating Temperature: -55°C; Max Operating Temperature: 125°C; Voltage Rating: 25V; Voltage Rating (DC): 25V; Packaging: Tape and Reel; Dielectric: X7R; Termination: SMD/SMT; Composition: Ceramic; Length: 1mm; Height: 0.5mm; Width: 0.02inch; Thickness: 0.022inch; Depth: 0.5mm; Radiation Hardening: No; Lead Free: Lead Free; Halogen Free: Halogen Free; ComponentLink2URL: https://datasheet.ciiva.com/11464/upy-gphc-x7r-6-3v-to-50v-8-11464889.pdf; ComponentLink2Description: https://datasheet.ciiva.com/11464/upy-gphc-x7r-6-3v-to-50v-8-11464889.pdf; ComponentLink3URL: https://datasheet.ciiva.com/13210/upy-gphc-x7r-6-3v-to-50v-8-12304-13210908.pdf; ComponentLink3Description: https://datasheet.ciiva.com/13210/upy-gphc-x7r-6-3v-to-50v-8-12304-13210908.pdf; ComponentLink4URL: https://datasheet.ciiva.com/17437/upy-gphc-x7r-6-3v-to-50v-8-17437357.pdf; ComponentLink4Description: https://datasheet.ciiva.com/17437/upy-gphc-x7r-6-3v-to-50v-8-17437357.pdf
CR1 = Y_7A-24.000MAAJ-T: Imported; Built_By: EMA_UL_Team; Type: DEV; C: Copyright (C) 2015 Accelerated Designs. All rights reserved; Description 1: CRYSTAL 24.000MHZ 18PF SMD; Frequency: 24MHz; Frequency Tolerance: 30ppm; ESR (Equivalent Series Resistance): 50R; Vendor: TXC; Manufacturer_Part_Number: 7A-24.000MAAJ-T; RefDes: RefDes; Value: Value; Supplier 1: Digi-Key; Supplier Part Number 1: 887-1090-1-ND; Stock 1: 70918; Pricing 1: 1=0.72, 10=0.633, 50=0.5912, 100=0.5225, 500=0.495 (USD); Mount: Surface Mount; Number of Pins: 2; Min Operating Temperature: -40°C; Max Operating Temperature: 70°C; Package Quantity: 1000; Tolerance: 30ppm; Packaging: Tape and Reel; Frequency Stability: 30ppm; Termination: SMD/SMT; Length: 5mm; Height: 0.053inch; Width: 3.2mm; Depth: 3.2mm; REACH SVHC: No SVHC; Lead Free: Lead Free; ComponentLink1URL: https://datasheet.ciiva.com/46431/1041607-46431974.pdf; ComponentLink1Description: https://datasheet.ciiva.com/46431/1041607-46431974.pdf; ComponentLink2URL: https://datasheet.ciiva.com/854/7a-854775.pdf; ComponentLink2Description: https://datasheet.ciiva.com/854/7a-854775.pdf; ComponentLink3URL: https://datasheet.ciiva.com/854/7a-854776.pdf; ComponentLink3Description: https://datasheet.ciiva.com/854/7a-854776.pdf; ComponentLink4URL: https://datasheet.ciiva.com/854/7a-854777.pdf; ComponentLink4Description: https://datasheet.ciiva.com/854/7a-854777.pdf; ComponentLink5URL: https://datasheet.ciiva.com/1356/1041607-1356396.pdf; ComponentLink5Description: https://datasheet.ciiva.com/1356/1041607-1356396.pdf
R61 R63 = R_0402_1.0M: RES 1.00M OHM 1/16W 1% 0402 SMD; Manufacturer: Vishay/Dale; Manufacturer Part Number: CRCW04021M00FKED; Temperature Coefficient: ±100ppm/°C; Supplier 1: Digi-Key; RoHS: RoHS Compliant; Category: Resistors; Stock 1: 232720; Pricing: 10=0.083, 50=0.0444, 200=0.0255, 1000=0.0174 (USD); Composition: Thick Film; Features: -; Lead Style: Surface Mount (SMD - SMT); Packaging: Digi-Reel®; ComponentLink1URL: http://www.vishay.com/doc?20035; ComponentLink1Description: http://www.vishay.com/doc?20035; Supplier Part Number 1: 541-1.00MLDKR-ND
R62 R64 = R_0402_0.00: RES 0.00 OHM 1/16W 1% 0402 SMD; Manufacturer: Yageo; Manufacturer Part Number: RC0402JR-070RL; Supplier 1: Digi-Key; RoHS: RoHS Compliant; Category: Resistors; Stock 1: 14041464; Pricing 1: 1=0.1, 10=0.01, 25=0.0068, 50=0.0052, 100=0.0038, 250=0.00288, 500=0.0023, 1000=0.0017, 5000=0.00122 (USD); Packaging: Cut Tape (CT); Part Status: Active; Composition: Thick Film; Features: Moisture Resistant; Temperature Coefficient: -; Operating Temperature: -55°C ~ 155°C; Package / Case: 0402 (1005 Metric); Supplier Device Package: 0402; Size / Dimension: 0.039" L x 0.020" W (1.00mm x 0.50mm); Height - Seated (Max): 0.016" (0.40mm); Failure Rate: -; ComponentLink1URL: http://www.yageo.com/documents/recent/PYu-RC_Group_51_RoHS_L_7.pdf; ComponentLink1Description: http://www.yageo.com/documents/recent/PYu-RC_Group_51_RoHS_L_7.pdf; Supplier Part Number 1: 311-0.0JRCT-ND
Y1 = Y_SMD_32KHZ: CRYSTAL 32.7680KHZ 12.5PF SMD; Manufacturer: Epson Toyocom Corporation; Manufacturer Part Number: FC-135 32.7680KA-A3; Frequency Tolerance: ±20ppm; Operating Mode: Fundamental; Supplier 1: Digi-Key; Supplier Part Number 1: SE2413CT-ND; RoHS: RoHS Compliant; Category: Crystals and Oscillators; Stock 1: 70403; Pricing: 1=2.98, 10=2.55, 50=2.125, 100=1.9125 (USD); Type: kHz Crystal (Tuning Fork); Frequency Stability: -; Load Capacitance: 12.5pF; Operating Temperature: -40°C ~ 85°C; Mounting Type: Surface Mount; Size / Dimension: 0.126" L x 0.059" W (3.20mm x 1.50mm); Height: 0.035" (0.90mm); Packaging: Cut Tape (CT); ComponentLink1URL: http://www.eea.epson.com/portal/pls/portal/docs/1/1087994.PDF; ComponentLink1Description: http://www.eea.epson.com/portal/pls/portal/docs/1/1087994.PDF
U2 = U_OSD3358-512M-BSM: Supplier 1: Digi-Key; Supplier Part Number 1: 1676-1002-ND; Stock 1: 592; Pricing 1: 1=43.73, 10=41.08, 100=36.84 (USD)